# EAGLE design DaisyChainController (EAGLE 9.2.2)
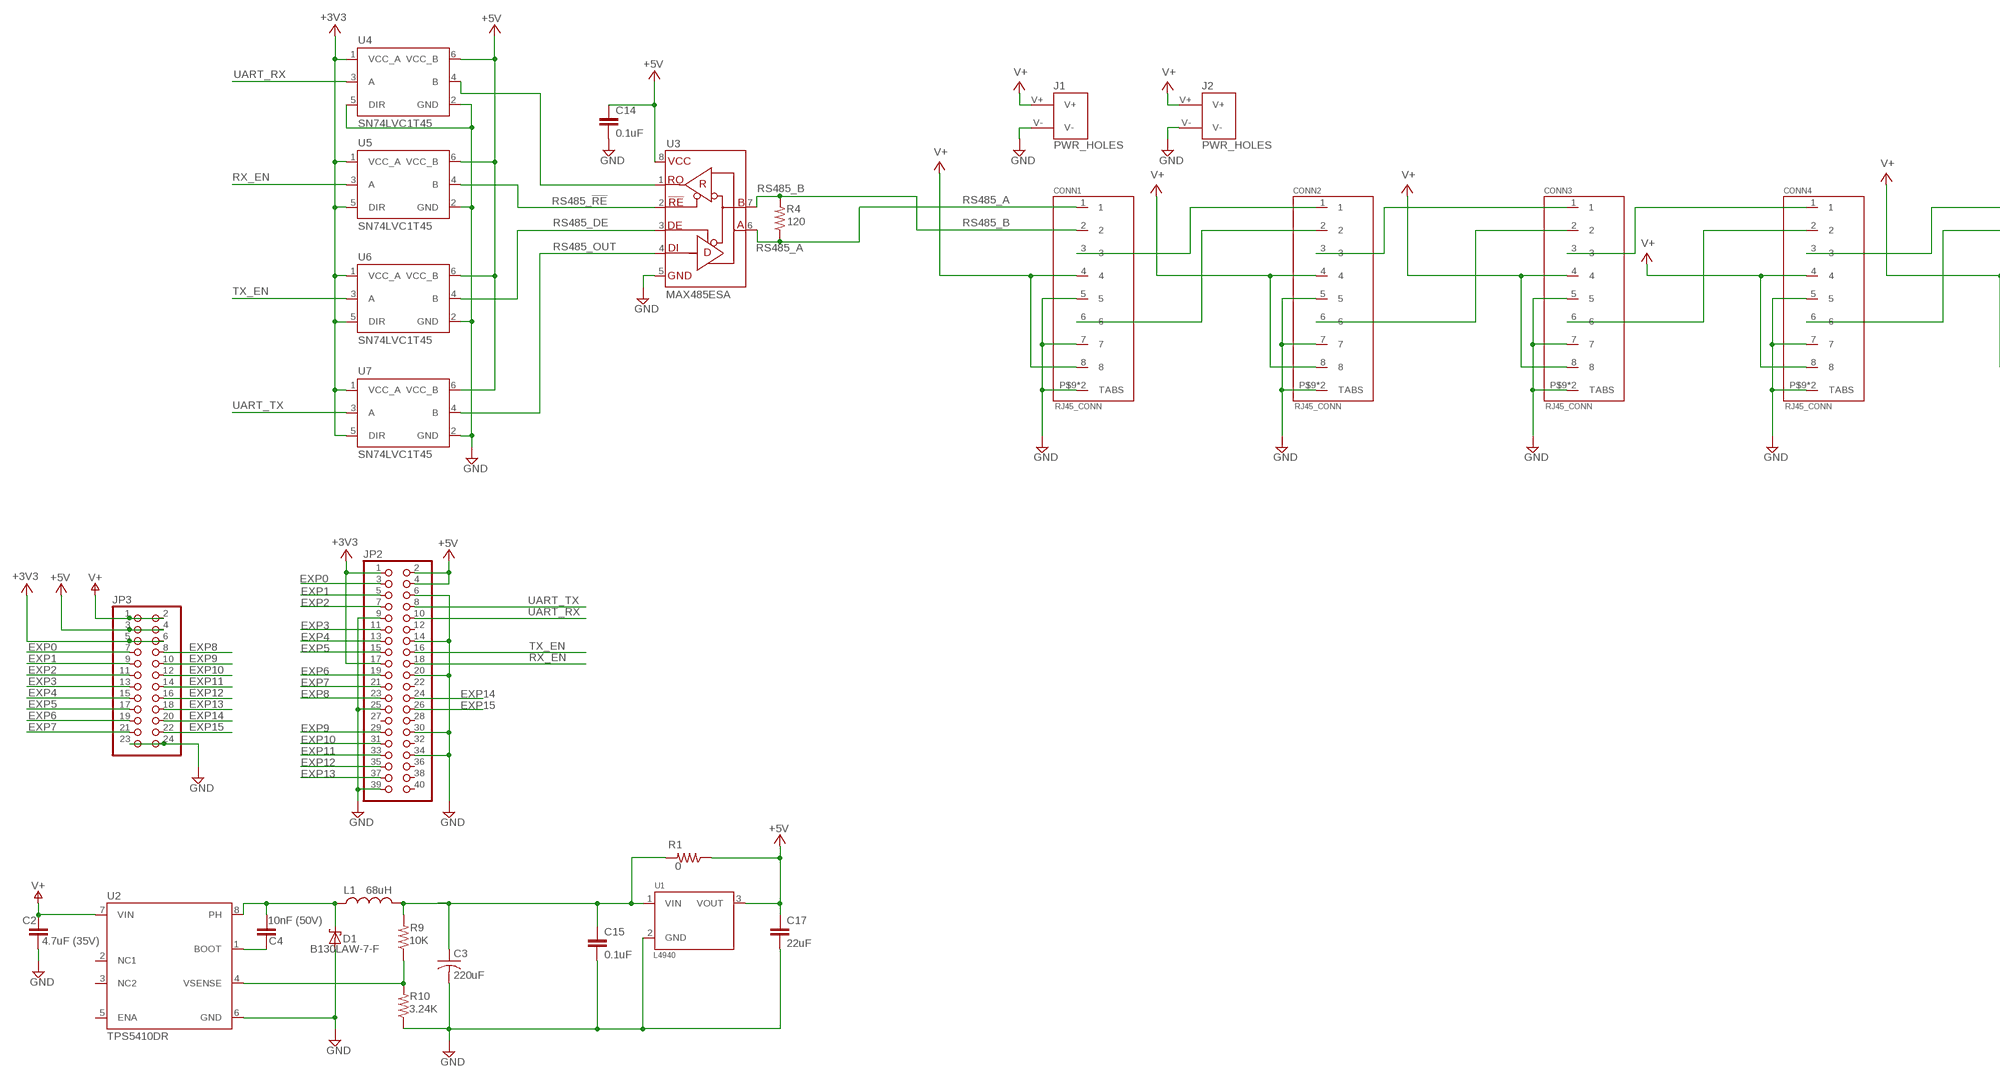
[diagram p0: schematic, sheet 1, part 1 of 2]
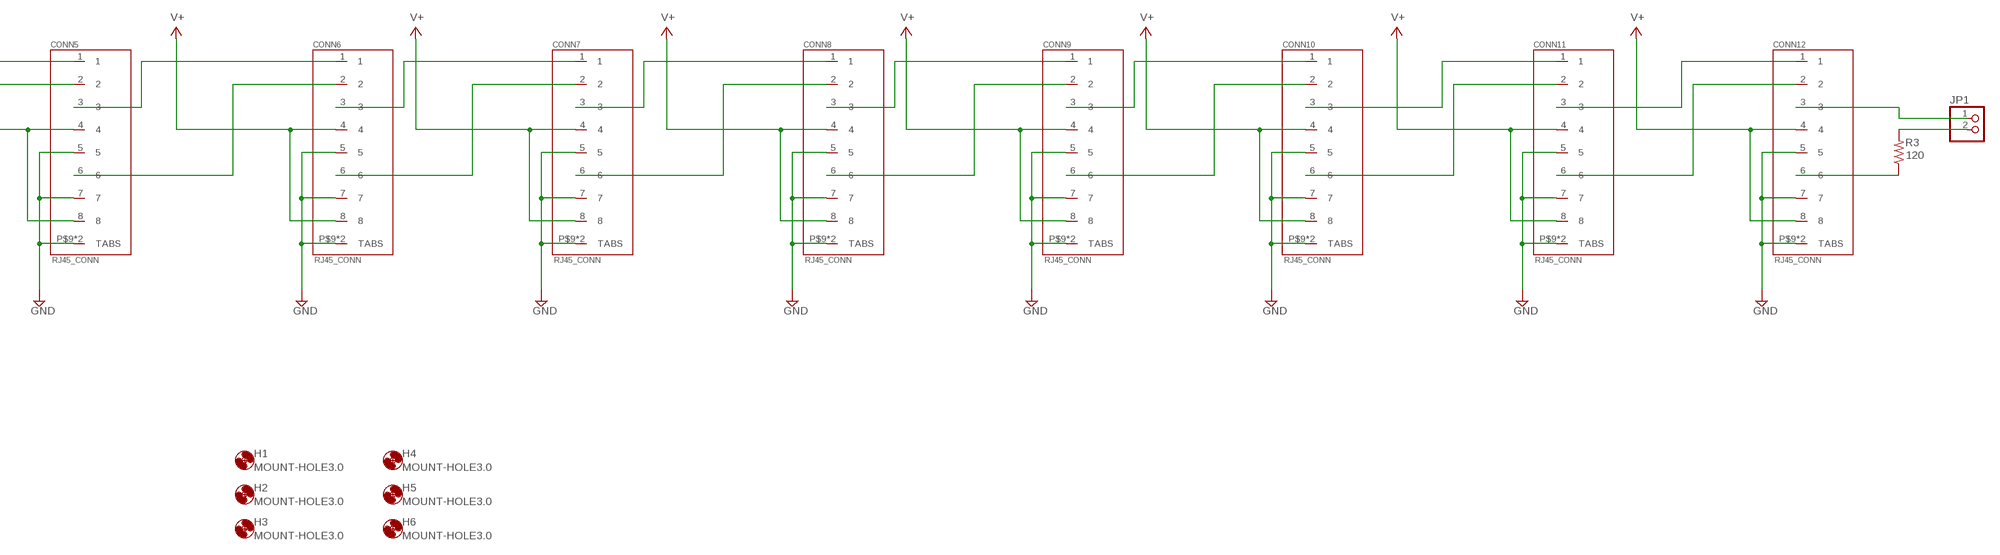
[diagram p1: schematic, sheet 1, part 2 of 2]

## Parts
C2  4.7uF (35V)  C-EUC0805  [C0805]
C3  220uF  TANT_CAP_D  [KEMET_D_CAP]
C4  10nF (50V)  C-EUC0805  [C0805]
C14  0.1uF  C-EUC0805  [C0805]
C15  0.1uF  C-EUC0805  [C0805]
C17  22uF  C-EUC0805  [C0805]
CONN1  RJ45_CONN  [RJ45_VERT]
CONN2  RJ45_CONN  [RJ45_VERT]
CONN3  RJ45_CONN  [RJ45_VERT]
CONN4  RJ45_CONN  [RJ45_VERT]
CONN5  RJ45_CONN  [RJ45_VERT]
CONN6  RJ45_CONN  [RJ45_VERT]
CONN7  RJ45_CONN  [RJ45_VERT]
CONN8  RJ45_CONN  [RJ45_VERT]
CONN9  RJ45_CONN  [RJ45_VERT]
CONN10  RJ45_CONN  [RJ45_VERT]
CONN11  RJ45_CONN  [RJ45_VERT]
CONN12  RJ45_CONN  [RJ45_VERT]
D1  B130LAW-7-F  [SOD123]
H1  MOUNT-HOLE3.0  [3,0]
H2  MOUNT-HOLE3.0  [3,0]
H3  MOUNT-HOLE3.0  [3,0]
H4  MOUNT-HOLE3.0  [3,0]
H5  MOUNT-HOLE3.0  [3,0]
H6  MOUNT-HOLE3.0  [3,0]
J1  PWR_HOLES  [PWR_HOLES]
J2  PWR_HOLES  [PWR_HOLES]
JP1  PINHD-1X2  [1X02]
JP2  PINHD-2X20/90  [2X20/90]
JP3  PINHD-2X12  [2X12]
L1  68uH  L_CDRH127  [CDRH127R]
R1  0  R-US_R0805  [R0805]
R3  120  R-US_R0805  [R0805]
R4  120  R-US_R0805  [R0805]
R9  10K  R-US_R0805  [R0805]
R10  3.24K  R-US_R0805  [R0805]
U1  L4940  [TO220]
U2  TPS5410DR  [SO08]
U3  MAX485ESA  [SO08]
U4  SN74LVC1T45  [SOT23-6]
U5  SN74LVC1T45  [SOT23-6]
U6  SN74LVC1T45  [SOT23-6]
U7  SN74LVC1T45  [SOT23-6]

## Nets
+3V3: JP2.1 JP2.17 JP3.5 JP3.6 U4.1(VCC_A) U5.1(VCC_A) U5.5(DIR) U6.1(VCC_A) U6.5(DIR) U7.1(VCC_A) U7.5(DIR)
+5V: C14.1 C17.1 JP2.2 JP2.4 JP3.3 JP3.4 R1.1 U1.3(VOUT) U3.8(VCC) U4.6(VCC_B) U5.6(VCC_B) U6.6(VCC_B) U7.6(VCC_B)
EXP0: JP2.3 JP3.7
EXP1: JP2.5 JP3.9
EXP2: JP2.7 JP3.11
EXP3: JP2.11 JP3.13
EXP4: JP2.13 JP3.15
EXP5: JP2.15 JP3.17
EXP6: JP2.19 JP3.19
EXP7: JP2.21 JP3.21
EXP8: JP2.23 JP3.8
EXP9: JP2.29 JP3.10
EXP10: JP2.31 JP3.12
EXP11: JP2.33 JP3.14
EXP12: JP2.35 JP3.16
EXP13: JP2.37 JP3.18
EXP14: JP2.24 JP3.20
EXP15: JP2.26 JP3.22
GND: C2.2 C3.- C14.2 C15.2 C17.2 CONN1.5 CONN1.7 CONN1.P$9(TABS) CONN1.P$10(TABS) CONN2.5 CONN2.7 CONN2.P$9(TABS) CONN2.P$10(TABS) CONN3.5 CONN3.7 CONN3.P$9(TABS) CONN3.P$10(TABS) CONN4.5 CONN4.7 CONN4.P$9(TABS) CONN4.P$10(TABS) CONN5.5 CONN5.7 CONN5.P$9(TABS) CONN5.P$10(TABS) CONN6.5 CONN6.7 CONN6.P$9(TABS) CONN6.P$10(TABS) CONN7.5 CONN7.7 CONN7.P$9(TABS) CONN7.P$10(TABS) CONN8.5 CONN8.7 CONN8.P$9(TABS) CONN8.P$10(TABS) CONN9.5 CONN9.7 CONN9.P$9(TABS) CONN9.P$10(TABS) CONN10.5 CONN10.7 CONN10.P$9(TABS) CONN10.P$10(TABS) CONN11.5 CONN11.7 CONN11.P$9(TABS) CONN11.P$10(TABS) CONN12.5 CONN12.7 CONN12.P$9(TABS) CONN12.P$10(TABS) D1.A J1.V- J2.V- JP2.6 JP2.9 JP2.14 JP2.20 JP2.25 JP2.30 JP2.34 JP2.39 JP3.23 JP3.24 R10.1 U1.2(GND) U2.6(GND) U3.5(GND) U4.2(GND) U4.5(DIR) U5.2(GND) U6.2(GND) U7.2(GND)
N$1: CONN1.6 CONN2.2
N$2: C3.+ C15.1 L1.P$2 R1.2 R9.2 U1.1(VIN)
N$3: CONN1.3 CONN2.1
N$4: CONN2.6 CONN3.2
N$5: CONN3.6 CONN4.2
N$6: CONN4.6 CONN5.2
N$7: CONN5.6 CONN6.2
N$8: CONN6.6 CONN7.2
N$9: CONN7.6 CONN8.2
N$10: CONN8.6 CONN9.2
N$11: CONN9.6 CONN10.2
N$12: CONN10.6 CONN11.2
N$13: CONN11.6 CONN12.2
N$14: CONN11.3 CONN12.1
N$15: CONN10.3 CONN11.1
N$16: U3.1(RO) U4.4(B)
N$17: CONN8.3 CONN9.1
N$18: CONN9.3 CONN10.1
N$19: CONN7.3 CONN8.1
N$20: CONN6.3 CONN7.1
N$21: R9.1 R10.2 U2.4(VSENSE)
N$22: C4.1 D1.C L1.1 U2.8(PH)
N$23: C4.2 U2.1(BOOT)
N$24: CONN5.3 CONN6.1
N$25: CONN3.3 CONN4.1
N$26: CONN2.3 CONN3.1
N$27: CONN12.3 JP1.1
N$28: CONN12.6 R3.1
N$29: JP1.2 R3.2
N$30: CONN4.3 CONN5.1
RS485_!RE: U3.2(!RE) U5.4(B)
RS485_A: CONN1.1 R4.1 U3.6(A)
RS485_B: CONN1.2 R4.2 U3.7(B)
RS485_DE: U3.3(DE) U6.4(B)
RS485_OUT: U3.4(DI) U7.4(B)
RX_EN: JP2.18 U5.3(A)
TX_EN: JP2.16 U6.3(A)
UART_RX: JP2.10 U4.3(A)
UART_TX: JP2.8 U7.3(A)
V+: C2.1 CONN1.4 CONN1.8 CONN2.4 CONN2.8 CONN3.4 CONN3.8 CONN4.4 CONN4.8 CONN5.4 CONN5.8 CONN6.4 CONN6.8 CONN7.4 CONN7.8 CONN8.4 CONN8.8 CONN9.4 CONN9.8 CONN10.4 CONN10.8 CONN11.4 CONN11.8 CONN12.4 CONN12.8 J1.V+ J2.V+ JP3.1 JP3.2 U2.7(VIN)
Unconnected: JP2.12 JP2.22 JP2.27 JP2.28 JP2.32 JP2.36 JP2.38 JP2.40 U2.2(NC1) U2.3(NC2) U2.5(ENA)

## Library data of the parts
C2 C4 C14 C15 C17 = rcl:C-EU: CAPACITOR, European symbol; SPICEPREFIX: C
C3 = DougsLab:TANT_CAP_D
CONN1-CONN12 = DougsLab:RJ45_CONN
D1 = DougsLab:B130LAW-7-F
H1-H6 = holes:MOUNT-HOLE: MOUNTING HOLE with drill center marker
J1 J2 = DougsLab:PWR_HOLES
JP1 = pinhead:PINHD-1X2: PIN HEADER
JP2 = pinhead:PINHD-2X20: PIN HEADER
JP3 = pinhead:PINHD-2X12: PIN HEADER
L1 = DougsLab:L_CDRH127
R1 R3 R4 R9 R10 = rcl:R-US_: RESISTOR, American symbol; SPICEPREFIX: R
U1 = DougsLab:L4940
U2 = DougsLab:TPS5410DR
U3 = DougsLab:MAX485ESA
U4-U7 = DougsLab:SN74LVC1T45

## Board
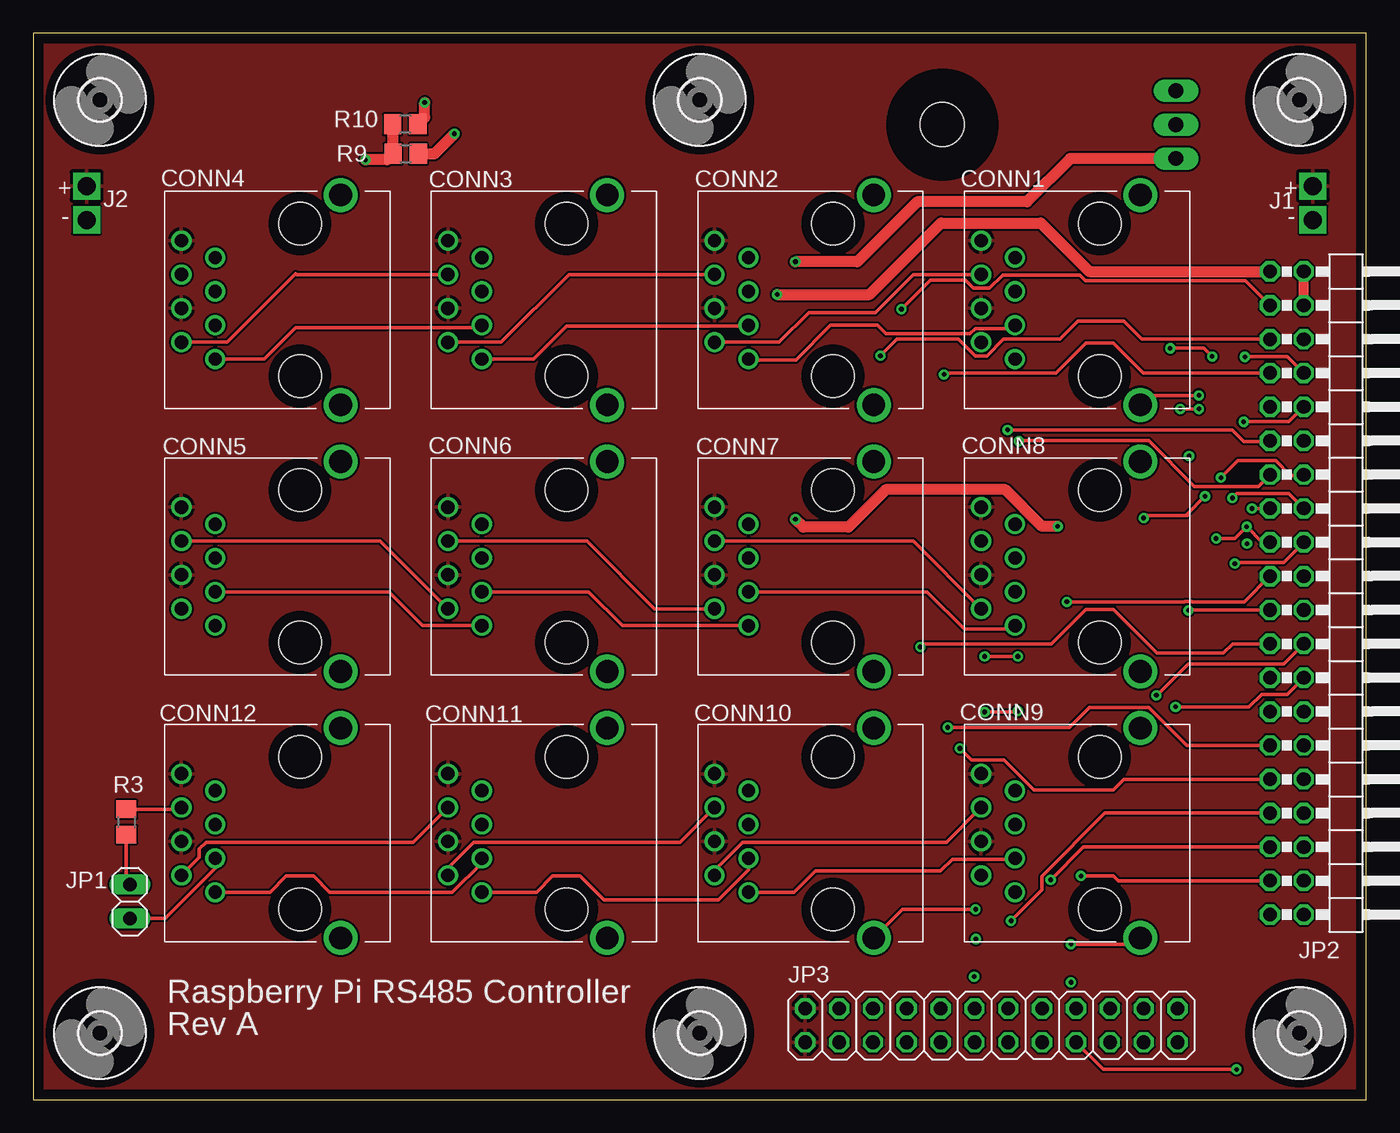
[diagram p2: board, top side]
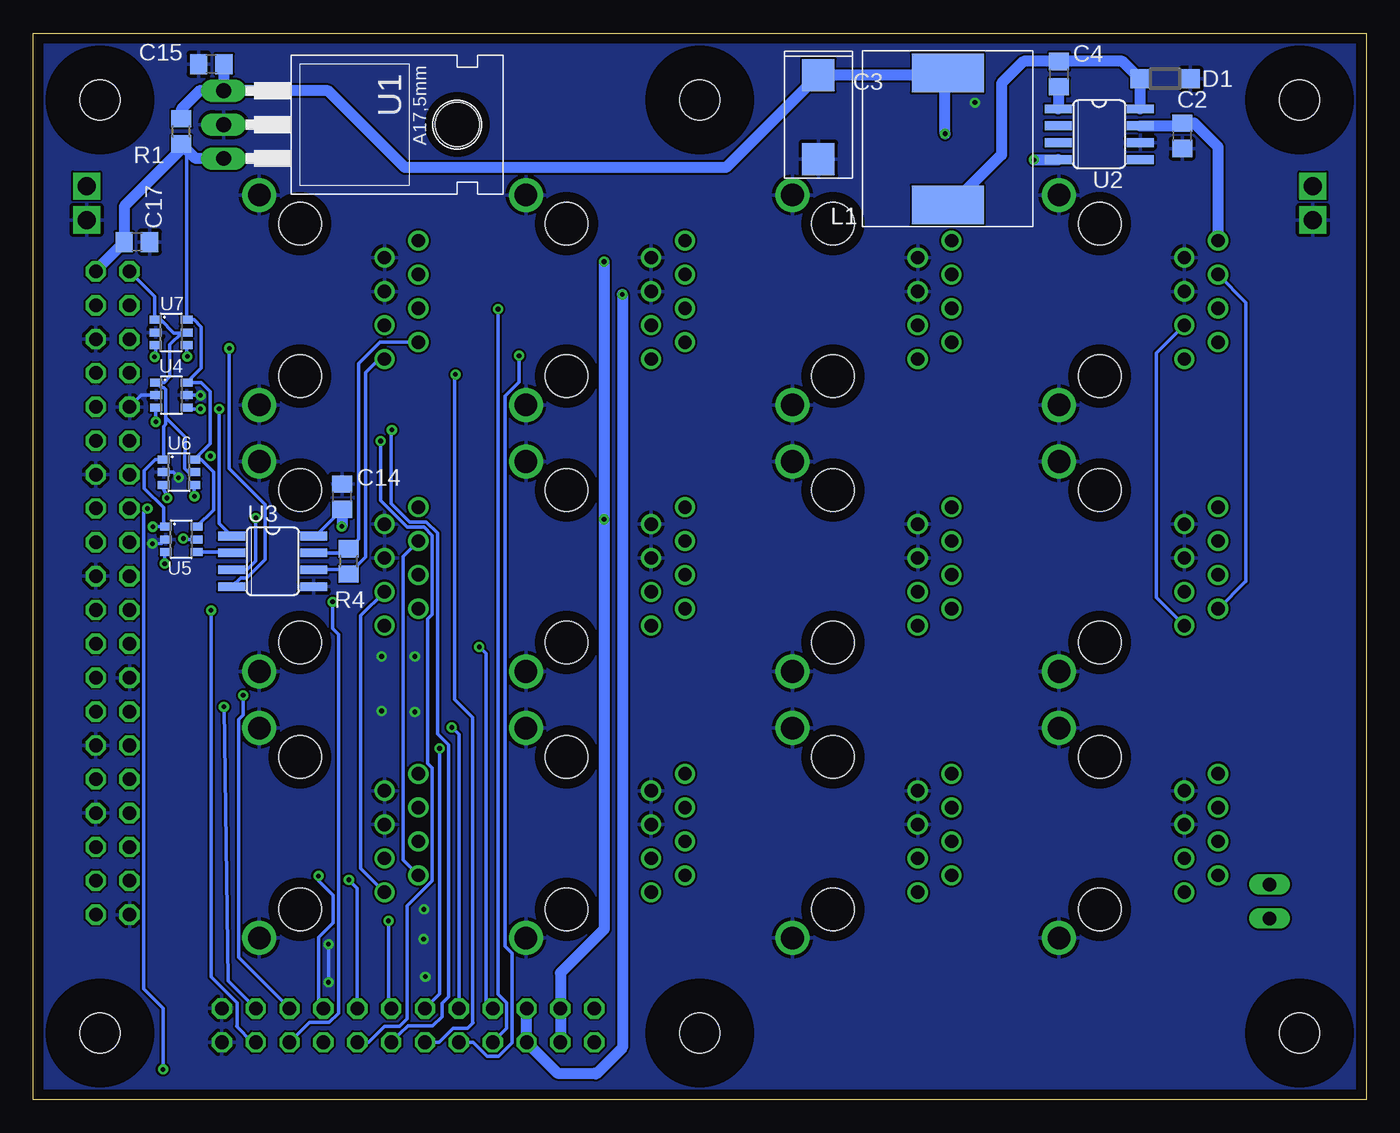
[diagram p3: board, bottom side, seen from below]

Size 100 x 80 mm. Coordinates in mm from the lower left corner, seen from the top.
Outline: 0,0 100,0 100,80 0,80 0,0
Copper layers (1*16): Top 0.035mm / dielectric 1.5mm / Bottom 0.035mm
Design rules "default *": minimum track width 6mil, minimum drill 0.35mm, track to track 6mil, track to pad 6mil, pad to pad 6mil, via to via 6mil, smd to smd 6mil, copper to edge 30mil, drill to drill 6mil, minimum pad ring 10mil, minimum via ring 8mil, stop-mask expansion 4mil, vias tented up to drill 0mil, thermal gap 10mil

### Footprints (pad centres in the part's own frame; a part is rotated, then mirrored left to right if it is on the bottom)
C0805 = smd 1.3 x 1.5: 1 -0.95,0; 2 0.95,0
KEMET_D_CAP = smd 2.43 x 2.43: + 3.15,0; - -3.15,0
RJ45_VERT = drill 1: 1 -4.445,6.35; 2 -3.175,8.89; 3 -1.905,6.35; 4 -0.635,8.89; 5 0.635,6.35; 6 1.905,8.89; 7 3.175,6.35; 8 4.445,8.89 | drill 1.7 pad 1.93: P$9 -7.875,-3.05; P$10 7.875,-3.05 | hole 3.2: -5.715,0; 5.715,0
SOD123 = smd 1.4 x 1.4: A 1.9,0; C -1.9,0
3,0 = hole 3: 0,0
PWR_HOLES = drill 1.35 square: V+ 0,2.54; V- 0,0
1X02 = drill 1.016 long: 1 -1.27,0; 2 1.27,0
2X20/90 = drill 1.016 octagon: 1 -24.13,-6.35; 2 -24.13,-3.81; 3 -21.59,-6.35; 4 -21.59,-3.81; 5 -19.05,-6.35; 6 -19.05,-3.81; 7 -16.51,-6.35; 8 -16.51,-3.81; 9 -13.97,-6.35; 10 -13.97,-3.81; 11 -11.43,-6.35; 12 -11.43,-3.81; 13 -8.89,-6.35; 14 -8.89,-3.81; 15 -6.35,-6.35; 16 -6.35,-3.81; 17 -3.81,-6.35; 18 -3.81,-3.81; 19 -1.27,-6.35; 20 -1.27,-3.81; 21 1.27,-6.35; 22 1.27,-3.81; 23 3.81,-6.35; 24 3.81,-3.81; 25 6.35,-6.35; 26 6.35,-3.81; 27 8.89,-6.35; 28 8.89,-3.81; 29 11.43,-6.35; 30 11.43,-3.81; 31 13.97,-6.35; 32 13.97,-3.81; 33 16.51,-6.35; 34 16.51,-3.81; 35 19.05,-6.35; 36 19.05,-3.81; 37 21.59,-6.35; 38 21.59,-3.81; 39 24.13,-6.35; 40 24.13,-3.81
2X12 = drill 1.016 octagon: 1 -13.97,-1.27; 2 -13.97,1.27; 3 -11.43,-1.27; 4 -11.43,1.27; 5 -8.89,-1.27; 6 -8.89,1.27; 7 -6.35,-1.27; 8 -6.35,1.27; 9 -3.81,-1.27; 10 -3.81,1.27; 11 -1.27,-1.27; 12 -1.27,1.27; 13 1.27,-1.27; 14 1.27,1.27; 15 3.81,-1.27; 16 3.81,1.27; 17 6.35,-1.27; 18 6.35,1.27; 19 8.89,-1.27; 20 8.89,1.27; 21 11.43,-1.27; 22 11.43,1.27; 23 13.97,-1.27; 24 13.97,1.27
CDRH127R = smd 5.4 x 2.9: 1 0,4.95; P$2 0,-4.95
R0805 = smd 1.3 x 1.5: 1 -0.95,0; 2 0.95,0
TO220 = drill 1.118 long: 1 -2.54,-6.35; 2 0,-6.35; 3 2.54,-6.35 | hole 3.302: 0,11.176
SO08 = smd 0.66 x 2.032: 1 -1.905,-3.073; 2 -0.635,-3.073; 3 0.635,-3.073; 4 1.905,-3.073; 5 1.905,3.073; 6 0.635,3.073; 7 -0.635,3.073; 8 -1.905,3.073
SOT23-6 = smd 0.6 x 0.9: 1 -0.95,-1.15; 2 0,-1.15; 3 0.95,-1.15; 4 0.95,1.15; 5 0,1.15; 6 -0.95,1.15

### Placement (x,y rotation side)
C2  13.81,72.31 270 bottom
C3  41.1,73.71 90 bottom
C4  23.05,76.95 270 bottom
C14  76.83,45.24 90 bottom
C15  86.64,77.7 180 bottom
C17  92.23,64.34 0 bottom
CONN1  80,60 90 top
CONN2  60,60 90 top
CONN3  40,60 90 top
CONN4  20,60 90 top
CONN5  20,40 90 top
CONN6  40,40 90 top
CONN7  60,40 90 top
CONN8  80,40 90 top
CONN9  80,20 90 top
CONN10  60,20 90 top
CONN11  40,20 90 top
CONN12  20,20 90 top
D1  15.08,76.59 0 bottom
H1  95,5 0 top
H2  50,5 0 top
H3  5,5 0 top
H4  95,75 0 top
H5  50,75 0 top
H6  5,75 0 top
J1  96,66 0 top
J2  4,66 0 top
JP1  7.24,14.86 90 top
JP2  99.13,38 270 top
JP3  71.88,5.56 0 top
L1  31.39,72.08 180 bottom
R1  88.9,72.64 90 bottom
R3  6.99,20.83 270 top
R4  76.33,40.39 90 bottom
R9  27.94,70.97 0 top
R10  27.91,73.18 180 top
U1  79.38,73.15 270 bottom
U2  20.03,72.42 270 bottom
U3  82.04,40.39 270 bottom
U4  89.64,52.86 270 bottom
U5  88.9,42.04 270 bottom
U6  89.08,47.07 270 bottom
U7  89.66,57.56 270 bottom

### Tracks (layer width: path | path; a pad name or v marks a point on that pad's centre or on a via)
+3V3  (via drill 0.35)
  Top 0.254: JP2.17 92.2,41.81 v91.04,42.98 90.15,42.09 v88.75,42.09
  Top 0.813: JP2.1 79.22,62.13 75.59,65.76 68.09,65.76 62.74,60.4 v55.8,60.4
  Bottom 0.254: JP2.1 90.88,60.23 90.88,58.58 U7.1 90.46,58.51 89.46,57.51 88.56,57.51 U7.5 88.85,57.56 89.76,56.64 89.76,54.23 90.19,53.81 U4.1 90.42,53.44 90.22,53.44 90.06,53.27 90.06,51.16 | 90.06,51.16 90.06,50.67 90.23,50.5 U6.1 90.43,48.02 90.45,48 90.87,48 91.67,47.2 91.67,45.86 90.23,44.42 90.23,43.16 U5.1 91.03,42.99 v91.04,42.98 | v88.75,42.09 88.57,42.04 U5.5 | U6.5 88.39,47.07 88.66,47.33 88.66,48.43 88.62,48.47 88.62,49.72 90.06,51.16
  Bottom 0.813: JP3.6 JP3.5 60.68,1.98 57.86,1.98 57.78,1.91 55.8,3.89 v55.8,60.4
+5V  (via drill 0.35)
  Top 0.762: JP2.4 JP2.2
  Top 0.813: v76.86,43 75.68,43 72.92,45.76 63.96,45.76 61.15,42.95 57.76,42.95 v57.17,43.54 | U1.3 77.8,70.61 74.55,67.36 66.32,67.36 61.82,62.87 v57.17,62.87
  Bottom 0.254: C14.1 78.83,42.29 U3.8 | U5.6 86.49,44.25 86.49,47.09 87.41,48.02 U6.6 86.72,49.23 86.72,53.11 87.41,53.81 U4.6 87.4,54.89 87.4,57.96 87.94,58.51 U7.6 88.51,71.31 R1.1
  Bottom 0.813: U1.3 87.82,70.61 R1.1 88.9,71.3 93.18,67.02 C17.1 95.32,62.2 JP2.2 | v57.17,62.87 v57.17,43.54 57.17,12.78 60.45,9.5 JP3.4 JP3.3 | C14.1 76.83,43.03 v76.86,43
EXP0  (via drill 0.35)
  Top 0.254: v65.13,59.31 67.31,61.49 69.93,61.49 70.55,60.87 71.74,60.87 72.75,61.87 78.51,61.87 78.94,61.44 90.92,61.44 JP2.3
  Bottom 0.254: v65.13,59.31 65.13,7.9 64.49,7.26 64.49,5.33 JP3.7
EXP1  (via drill 0.35)
  Top 0.254: v63.55,55.8 64.8,57.05 69.42,57.05 70.68,55.79 71.54,55.79 72.8,57.05 77.02,57.05 78.37,58.4 81.81,58.4 83.16,57.05 JP2.5
  Bottom 0.254: v63.55,55.8 63.55,53.82 64.6,52.77 64.6,11.48 64.08,10.96 64.08,4.27 65.1,3.25 65.96,3.25 67,4.29 JP3.9
EXP2  (via drill 0.35)
  Top 0.254: v68.33,54.41 68.43,54.51 76.7,54.51 78.97,56.77 81.03,56.77 83.3,54.51 JP2.7
  Bottom 0.254: v68.33,54.41 68.38,54.36 68.38,30.01 67.03,28.67 67.03,5.77 67,5.74 67.41,5.33 68.5,5.33 69.55,4.29 JP3.11
EXP3  (via drill 0.35)
  Top 0.254: v73.1,50.24 89.97,50.24 90.83,49.38 92.72,49.38 JP2.11
  Bottom 0.254: v73.1,50.24 73.15,50.19 73.15,44.71 71.78,43.34 70.51,43.34 69.67,42.5 69.67,27.42 68.86,26.61 68.86,7.69 69.34,7.21 69.34,6.22 70.03,5.54 71.89,5.54 72.5,4.93 72.52,4.93 JP3.13
EXP4  (via drill 0.35)
  Top 0.254: JP2.13 91.89,46 87.12,46 83.69,49.43 82.41,49.43 73.97,49.43 v73.94,49.4
  Bottom 0.254: v73.94,49.4 73.94,44.93 71.95,42.94 70.68,42.94 70.08,42.33 70.08,36.4 70.43,36.04 70.43,25.23 70.08,24.87 70.08,16.4 71.96,14.52 71.96,6.04 72.52,5.49 73.66,5.49 74.85,4.29 JP3.15
EXP5  (via drill 0.35)
  Top 0.254: JP2.15 v91.44,44.35 | v90.27,2.26 80.26,2.26 JP3.17
  Bottom 0.254: v91.44,44.35 91.72,44.07 91.72,8.31 90.27,6.86 v90.27,2.26
EXP6  (via drill 0.35)
  Top 0.254: JP2.19 90.84,37.34 86.96,37.34 86.94,37.36 86.39,37.36 86.37,37.34 v77.55,37.34
  Bottom 0.254: v77.55,37.34 77.55,35.35 77.11,34.91 77.11,6.49 77.8,5.79 79.27,5.79 JP3.19
EXP7  (via drill 0.35)
  Top 0.254: JP2.21 86.69,36.73 v86.67,36.7
  Bottom 0.254: v86.67,36.7 86.67,9.22 84.71,7.26 84.71,5.54 84.76,5.49 83.57,4.29 JP3.21
EXP8  (via drill 0.35)
  Top 0.254: JP2.23 89.98,34.19 89.3,33.51 84.3,33.51 81.03,36.77 78.97,36.77 76.39,34.19 66.78,34.19 v66.55,33.96
  Bottom 0.254: JP3.8 66.04,7.34 66.04,33.45 v66.55,33.96
EXP9  (via drill 0.35)
  Top 0.254: JP2.29 86.55,26.57 83.69,29.43 79.23,29.43 77.71,27.91 v68.61,27.91
  Bottom 0.254: v68.61,27.91 68.07,27.38 JP3.10
EXP10  (via drill 0.35)
  Top 0.254: JP2.31 81.83,24.03 81.03,23.23 75.06,23.23 72.81,25.48 70.38,25.48 v69.52,26.34
  Bottom 0.254: v69.52,26.34 69.52,7.92 JP3.12
EXP11  (via drill 0.35)
  Top 0.254: v73.36,13.41 75.67,15.72 75.67,16.76 80.4,21.49 JP2.33
  Bottom 0.254: v73.36,13.41 73.36,7.04 JP3.14
EXP12  (via drill 0.35)
  Top 0.254: JP2.35 78.79,18.95 v76.33,16.48
  Bottom 0.254: v76.33,16.48 75.69,15.85 JP3.16
EXP13  (via drill 0.35)
  Top 0.254: JP2.37 81.39,16.41 81.03,16.77 78.97,16.77 78.96,16.77 v78.61,16.77
  Bottom 0.254: JP3.18 78.61,7.21 78.61,12.16 77.51,13.25 77.51,15.32 78.61,16.41 v78.61,16.77
EXP14  (via drill 0.35)
  Top 0.254: JP2.24 93.82,32.69 86.65,32.69 84.29,30.33 v84.25,30.33
  Bottom 0.254: v84.25,30.33 84.25,28.87 84.6,28.52 84.6,10.66 JP3.20
EXP15  (via drill 0.35)
  Top 0.254: v85.7,29.46 91.21,29.46 92.15,30.4 94.07,30.4 JP2.26
  Bottom 0.254: v85.7,29.46 85.37,8.89 JP3.22
GND  (via drill 0.35)
  Top 0.254: JP2.14 95.26,46.83 94.31,46.83 93.21,47.93 90.38,47.93 v89.1,46.66 | v87.45,52.83 83.76,52.83 CONN1.P$9 | v71.37,33.25 v73.86,33.25 | v71.37,29.08 73.79,29.08 v73.86,29.16 | v77.85,11.66 82.58,11.66 CONN9.P$9 | v70.69,14.28 65.2,14.28 CONN10.P$9
  Top 0.813: R10.1 29.36,73.68 v29.36,74.8
  Bottom 0.254: U4.5 87.48,52.86 v87.45,52.83 | U4.2 91.89,52.86 JP2.9 | U5.2 90.38,41.71 v91.06,41.71 | v77.85,8.79 v77.85,11.66 | U6.2 89.51,47.07 v89.1,46.66
  other vias: 70.71,12.04 70.59,9.22
  pour Bottom: 0,66.93 0,80 87.83,79.99 99.93,79.92 99.93,79.92 99.93,66.93 100,66.93 100,0 0,0
N$1
  Top 0.254: CONN2.2 55.96,56.83 58.19,59.05 63.2,59.05 66.04,61.9 CONN1.6
N$2  (via drill 0.35)
  Top 0.813: R9.2 30.1,70.97 v31.6,72.47
  Bottom 0.813: v31.6,72.47 31.6,76.82 L1.P$2 31.56,76.86 C3.+ 48.03,69.93 72.11,69.93 77.88,75.69 U1.1 | U1.1 85.69,75.73 C15.1 | U1.1 87.45,75.69 87.48,75.72 88.9,74.3 R1.2
N$3
  Top 0.254: CONN2.1 53.71,55.5 57.2,55.5 59.8,58.09 63.32,58.09 63.96,57.45 64.63,57.45 64.63,57.46 69.59,57.46 69.59,57.45 70.28,57.45 70.68,57.86 72.06,57.86 73.42,57.86 CONN1.3
N$4
  Top 0.254: CONN2.6 40.19,61.91 35.11,56.83 CONN3.2
N$5
  Top 0.254: CONN3.6 19.76,61.91 19.68,61.98 14.53,56.83 CONN4.2
N$6
  Bottom 0.254: CONN5.2 9.07,38.86 9.02,38.86 9.02,59.81 CONN4.6
N$7
  Top 0.254: CONN5.6 26.03,41.91 CONN6.2
N$8
  Top 0.254: CONN6.6 41.52,41.91 41.53,41.91 46.61,36.83 CONN7.2
N$9
  Top 0.254: CONN7.6 66.03,41.91 CONN8.2
N$10
  Bottom 0.254: CONN9.2 72.26,17.98 72.26,40.75 CONN8.6
N$11
  Top 0.254: CONN10.2 51.1,17.2 53.21,19.3 68.51,19.3 CONN9.6
N$12
  Top 0.254: CONN11.2 31.11,17.39 33.02,19.3 48.51,19.3 CONN10.6
N$13
  Top 0.254: CONN12.2 12.45,18.16 12.45,18.8 12.95,19.3 28.51,19.3 CONN11.6
N$14
  Top 0.254: CONN12.1 17.75,15.55 18.97,16.77 21.03,16.77 22.25,15.55 31.43,15.55 33.65,17.77 CONN11.3
N$15
  Top 0.254: CONN11.1 37.75,15.55 38.97,16.77 41.03,16.77 42.81,15 51.42,15 53.65,17.23 CONN10.3
N$16  (via drill 0.35)
  Top 0.254: v86.06,51.82 v87.45,51.82
  Bottom 0.254: v87.45,51.82 88.39,51.82 U4.4 | U3.1 86.06,43.23 v86.06,51.82
N$17
  Bottom 0.254: CONN9.1 75.44,17.34 75.44,36.31 CONN8.3
N$18
  Top 0.254: CONN10.1 57.08,15.55 58.67,17.14 68.07,17.14 68.96,18.03 73.59,18.03 CONN9.3
N$19
  Top 0.254: CONN7.3 67.06,38.09 69.85,35.31 73.4,35.31 CONN8.1
N$20
  Top 0.254: CONN6.3 41.65,38.09 41.66,38.1 44.2,35.56 CONN7.1
N$21  (via drill 0.35)
  Top 0.813: R10.2 26.99,73.14 R9.1 26.53,70.51 v24.92,70.51
  Bottom 0.813: v24.92,70.51 23.11,70.51 U2.4
N$22
  Bottom 0.813: U2.8 16.96,76.57 D1.C 18.28,77.9 C4.1 25.71,77.9 27.36,76.25 27.36,70.89 31.12,67.13 L1.1
N$23
  Bottom 0.813: C4.2 23.1,75.95 U2.1
N$24
  Top 0.254: CONN5.3 26.68,38.09 29.21,35.55 CONN6.1
N$25
  Top 0.254: CONN3.3 33.47,57.91 19.68,57.91 17.33,55.55 CONN4.1
N$26
  Top 0.254: CONN2.3 53.59,58.04 40.01,58.04 37.52,55.55 CONN3.1
N$27
  Top 0.254: JP1.1 9.91,13.59 13.65,17.33 CONN12.3
N$28
  Top 0.254: R3.1 10.98,21.78 CONN12.6
N$29
  Top 0.254: R3.2 6.99,16.38 JP1.2
N$30
  Bottom 0.254: CONN4.3 15.75,56 15.75,37.65 CONN5.1
N$39  (via drill 0.35)
  other vias: 86.72,48.29
RS485_!RE
  Bottom 0.254: U5.4 85.18,41.09 U3.2
RS485_A
  Bottom 0.254: U3.6 76.64,39.75 R4.1 75.06,40.71 75.06,54.56 74.06,55.55 CONN1.1
RS485_B
  Bottom 0.254: U3.7 76.64,41.02 R4.2 75.59,42.07 75.59,55.22 73.98,56.83 CONN1.2
RS485_DE  (via drill 0.35)
  Top 0.254: v83.31,43.64 83.49,43.81 86.59,43.81 86.59,43.94 v87.91,45.26
  Bottom 0.254: U3.3 83.97,39.75 83.31,40.41 v83.31,43.64 | v87.91,45.26 87.93,45.28 U6.4
RS485_OUT  (via drill 0.35)
  Top 0.254: v85.29,56.36 87.83,56.36 v88.44,55.75
  Bottom 0.254: U3.4 84.45,39.14 83.98,39.14 82.6,40.52 82.6,44.65 85.29,47.35 v85.29,56.36 | v88.44,55.75 88.51,55.82 U7.4
RX_EN  (via drill 0.35)
  Top 0.254: JP2.18 93.82,40.31 93.21,40.31 90.25,40.31 v90.14,40.21
  Bottom 0.254: v90.14,40.21 90.14,40.99 U5.3
TX_EN  (via drill 0.35)
  Top 0.254: JP2.16 94.2,45.47 90.3,45.47 v89.97,45.14
  Bottom 0.254: U6.3 90.33,46.02 89.93,45.17 v89.97,45.14
UART_RX  (via drill 0.35)
  Top 0.254: JP2.10 94.2,50.85 v90.81,50.85
  Bottom 0.254: v90.81,50.85 90.81,51.89 U4.3
UART_TX  (via drill 0.35)
  Top 0.254: JP2.8 94.1,55.73 v90.91,55.73
  Bottom 0.254: v90.91,55.73 90.81,55.82 U7.3
V+
  Bottom 0.813: CONN4.8 11.11,71.46 12.91,73.26 C2.1 14.01,73.06 U2.7
  pour Top: 0,80 100,80 100,0 0,0
  pour Bottom: 99.95,72.52

### Text on the board
tPlace: Raspberry Pi RS485 Controller | Rev A